# EAGLE schematic untitled_panelized (EAGLE 9.5.0)
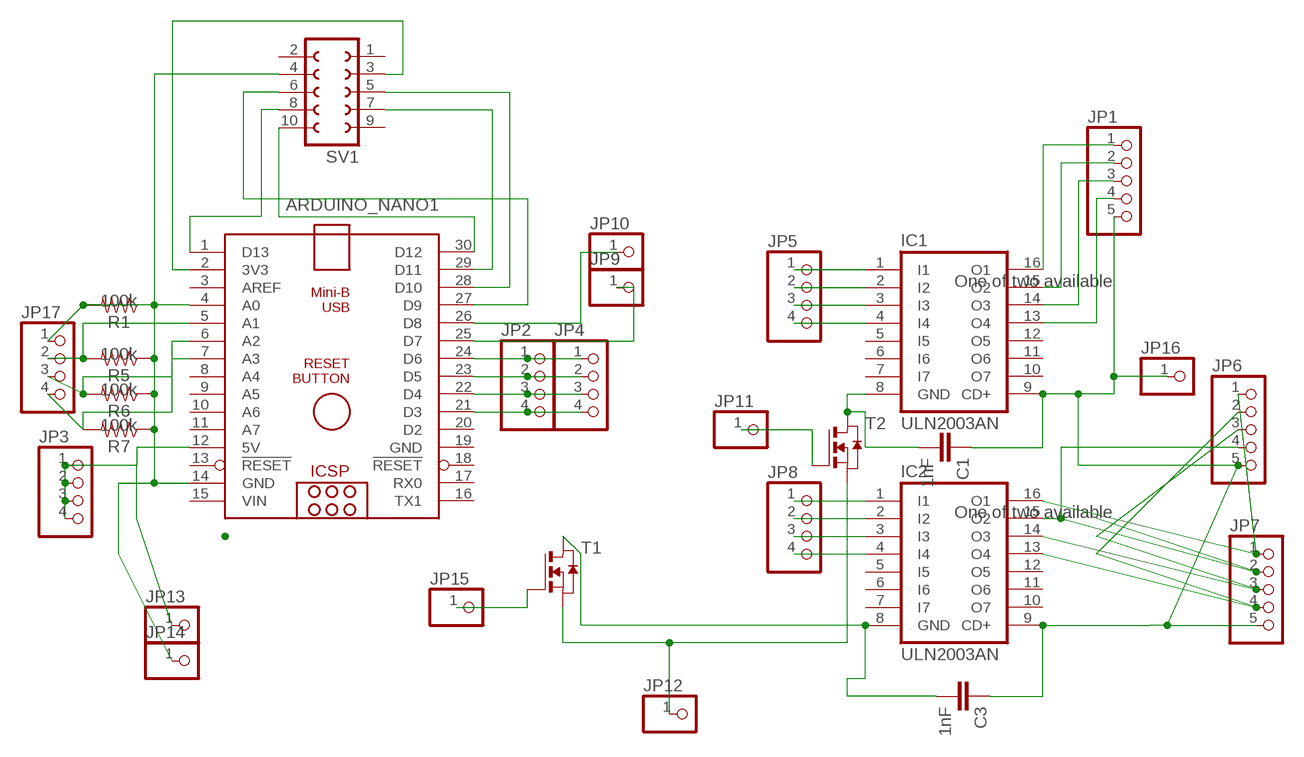
[diagram p0: schematic, sheet 1]

## Parts
ARDUINO_NANO1  ARDUINO_NANO  [ARDUINO_NANO]
C1  1nF  1.0NF/1000PF-0603-50V-10%  [0603]
C3  1nF  1.0NF/1000PF-0603-50V-10%  [0603]
IC1  ULN2003AN  [DIL16]
IC2  ULN2003AN  [DIL16]
JP1  PINHD-1X5  [1X05]
JP2  PINHD-1X4  [1X04]
JP3  PINHD-1X4  [1X04]
JP4  PINHD-1X4  [1X04]
JP5  PINHD-1X4  [1X04]
JP6  PINHD-1X5  [1X05]
JP7  PINHD-1X5  [1X05]
JP8  PINHD-1X4  [1X04]
JP9  PINHD-1X1  [1X01]
JP10  PINHD-1X1  [1X01]
JP11  PINHD-1X1  [1X01]
JP12  PINHD-1X1  [1X01]
JP13  PINHD-1X1  [1X01]
JP14  PINHD-1X1  [1X01]
JP15  PINHD-1X1  [1X01]
JP16  PINHD-1X1  [1X01]
JP17  PINHD-1X4  [1X04]
R1  100k  100KOHM-0603-1/10W-1%  [0603]
R5  100k  100KOHM-0603-1/10W-1%  [0603]
R6  100k  100KOHM-0603-1/10W-1%  [0603]
R7  100k  100KOHM-0603-1/10W-1%  [0603]
SV1  FE05-2  [FE05-2]
T1  NMOSSOT89  [SOT89]
T2  NMOSSOT89  [SOT89]

## Nets
3V3: ARDUINO_NANO1.1(D13) SV1.8
GND1: ARDUINO_NANO1.14(GND) JP14.1 R1.1 R5.1 R6.1 R7.1 SV1.4
GND2: JP12.1 T1.3(S) T2.3(S)
LONGTHINGY: IC2.15(O2) JP6.4 JP7.2
N$1: ARDUINO_NANO1.4(A0) JP17.1 R1.2
N$3: ARDUINO_NANO1.21(D3) JP2.4 JP4.4
N$4: ARDUINO_NANO1.30(D12) SV1.10
N$6: IC2.16(O1) JP6.1 JP7.1
N$8: IC2.14(O3) JP6.3 JP7.3
N$9: IC2.13(O4) JP6.2 JP7.4
N$11: IC1.16(O1) JP1.1
N$12: IC1.15(O2) JP1.2
N$13: IC1.14(O3) JP1.3
N$14: IC1.13(O4) JP1.4
N$15: ARDUINO_NANO1.22(D4) JP2.3 JP4.3
N$17: ARDUINO_NANO1.25(D7) JP9.1
N$18: ARDUINO_NANO1.23(D5) JP2.2 JP4.2
N$21: ARDUINO_NANO1.29(D11) SV1.7
N$22: ARDUINO_NANO1.28(D10) SV1.5
N$23: ARDUINO_NANO1.27(D9) SV1.6
N$24: ARDUINO_NANO1.24(D6) JP2.1 JP4.1
N$25: ARDUINO_NANO1.2(3V3) SV1.3
N$27: IC1.1(I1) JP5.1
N$28: IC1.2(I2) JP5.2
N$29: IC1.3(I3) JP5.3
N$30: IC1.4(I4) JP5.4
N$31: IC2.1(I1) JP8.1
N$32: IC2.2(I2) JP8.2
N$33: IC2.3(I3) JP8.3
N$34: IC2.4(I4) JP8.4
N$35: ARDUINO_NANO1.26(D8) JP10.1
N$36: JP11.1 T2.1(G)
N$37: JP15.1 T1.1(G)
N$39: ARDUINO_NANO1.5(A1) JP17.2 R5.2
N$40: ARDUINO_NANO1.6(A2) JP17.3 R6.2
N$41: ARDUINO_NANO1.7(A3) JP17.4 R7.2
ULN1GND: C1.2 IC1.8(GND) T2.2(D) T2.2@1(D)
ULN2GND: C3.2 IC2.8(GND) T1.2(D) T1.2@1(D)
VCC1: ARDUINO_NANO1.12(5V) JP3.1 JP3.2 JP3.3 JP3.4 JP13.1
VCC2: C1.1 C3.1 IC1.9(CD+) IC2.9(CD+) JP1.5 JP6.5 JP7.5 JP16.1
Unconnected: ARDUINO_NANO1.3(AREF) ARDUINO_NANO1.8(A4) ARDUINO_NANO1.9(A5) ARDUINO_NANO1.10(A6) ARDUINO_NANO1.11(A7) ARDUINO_NANO1.13(!RESET) ARDUINO_NANO1.16(TX1) ARDUINO_NANO1.17(RX0) ARDUINO_NANO1.18(!RESET) ARDUINO_NANO1.20(D2) IC1.5(I5) IC1.6(I6) IC1.7(I7) IC1.10(O7) IC1.11(O6) IC1.12(O5) IC2.5(I5) IC2.6(I6) IC2.7(I7) IC2.10(O7) IC2.11(O6) IC2.12(O5) SV1.1 SV1.2 SV1.9

## Power pins joined to a net without a drawn wire
GND: ARDUINO_NANO1.19(GND)
VIN: ARDUINO_NANO1.15(VIN)

## Library data of the parts
ARDUINO_NANO1 = ArduinoNanoV30:ARDUINO_NANO: Arduino Nano V3.0 Overview: The Arduino Nano is a small, complete, and breadboard-friendly board based on the ATmega328 (Arduino Nano 3.x) or ATmega168 (Arduino Nano 2.x). It has more or less the same functionality of the Arduino Duemilanove, but in a different package. It lacks only a DC power jack, and works with a Mini-B USB cable instead of a standard one. The Nano was designed and is being produced by Gravitech. Specifications: Microcontroller Atmel ATmega168 or ATmega328 Operating Voltage (logic level) 5 V Input Voltage (recommended) 7-12 V Input Voltage (limits) 6-20 V Digital I/O Pins 14 (of which 6 provide PWM output) Analog Input Pins 8 DC Current per I/O Pin 40 mA Flash Memory 16 KB (ATmega168) or 32 KB (ATmega328) of which 2 KB used by bootloader SRAM 1 KB (ATmega168) or 2 KB (ATmega328) EEPROM 512 bytes (ATmega168) or 1 KB (ATmega328) Clock Speed 16 MHz Dimensions 0.73" x 1.70" Length 45 mm Width 18 mm Weigth 5 g Power: The Arduino Nano can be powered via the Mini-B USB connection, 6-20V unregulated external power supply (pin 30), or 5V regulated external power supply (pin 27). The power source is automatically selected to the highest voltage source. Memory: The ATmega168 has 16 KB of flash memory for storing code (of which 2 KB is used for the bootloader); the ATmega328 has 32 KB, (also with 2 KB used for the bootloader). The ATmega168 has 1 KB of SRAM and 512 bytes of EEPROM (which can be read and written with the EEPROM library); the ATmega328 has 2 KB of SRAM and 1 KB of EEPROM. Input and Output: Each of the 14 digital pins on the Nano can be used as an input or output, using pinMode(), digitalWrite(), and digitalRead() functions. They operate at 5 volts. Each pin can provide or receive a maximum of 40 mA and has an internal pull-up resistor (disconnected by default) of 20-50 kOhms. In addition, some pins have specialized functions. Visit Arduino - ArduinoBoardNano <https://www.arduino.cc/en/Main/ArduinoBoardNano>
C1 C3 = SparkFun-Capacitors:1.0NF/1000PF: 1nF/1,000pF ceramic capacitors A capacitor is a passive two-terminal electrical component used to store electrical energy temporarily in an electric field.; PROD_ID: CAP-07886
IC1 IC2 = uln-udn:ULN2003A: DRIVER ARRAY; A: One of two available
JP1 JP6 JP7 = pinhead:PINHD-1X5: PIN HEADER
JP2-JP5 JP8 JP17 = pinhead:PINHD-1X4: PIN HEADER
JP9-JP16 = pinhead:PINHD-1X1: PIN HEADER
R1 R5-R7 = SparkFun-Resistors:100KOHM: 100kΩ resistor A resistor is a passive two-terminal electrical component that implements electrical resistance as a circuit element. Resistors act to reduce current flow, and, at the same time, act to lower voltage levels within circuits. - Wikipedia; PROD_ID: RES-07828
SV1 = con-lsta:FE05-2: FEMALE HEADER; OC_FARNELL: unknown; OC_NEWARK: unknown
T1 T2 = zetex:NMOSSOT89: MOS FET; OC_FARNELL: unknown; OC_NEWARK: unknown